# Altium schematic sheet RPI-CM3.SchDoc
size A2
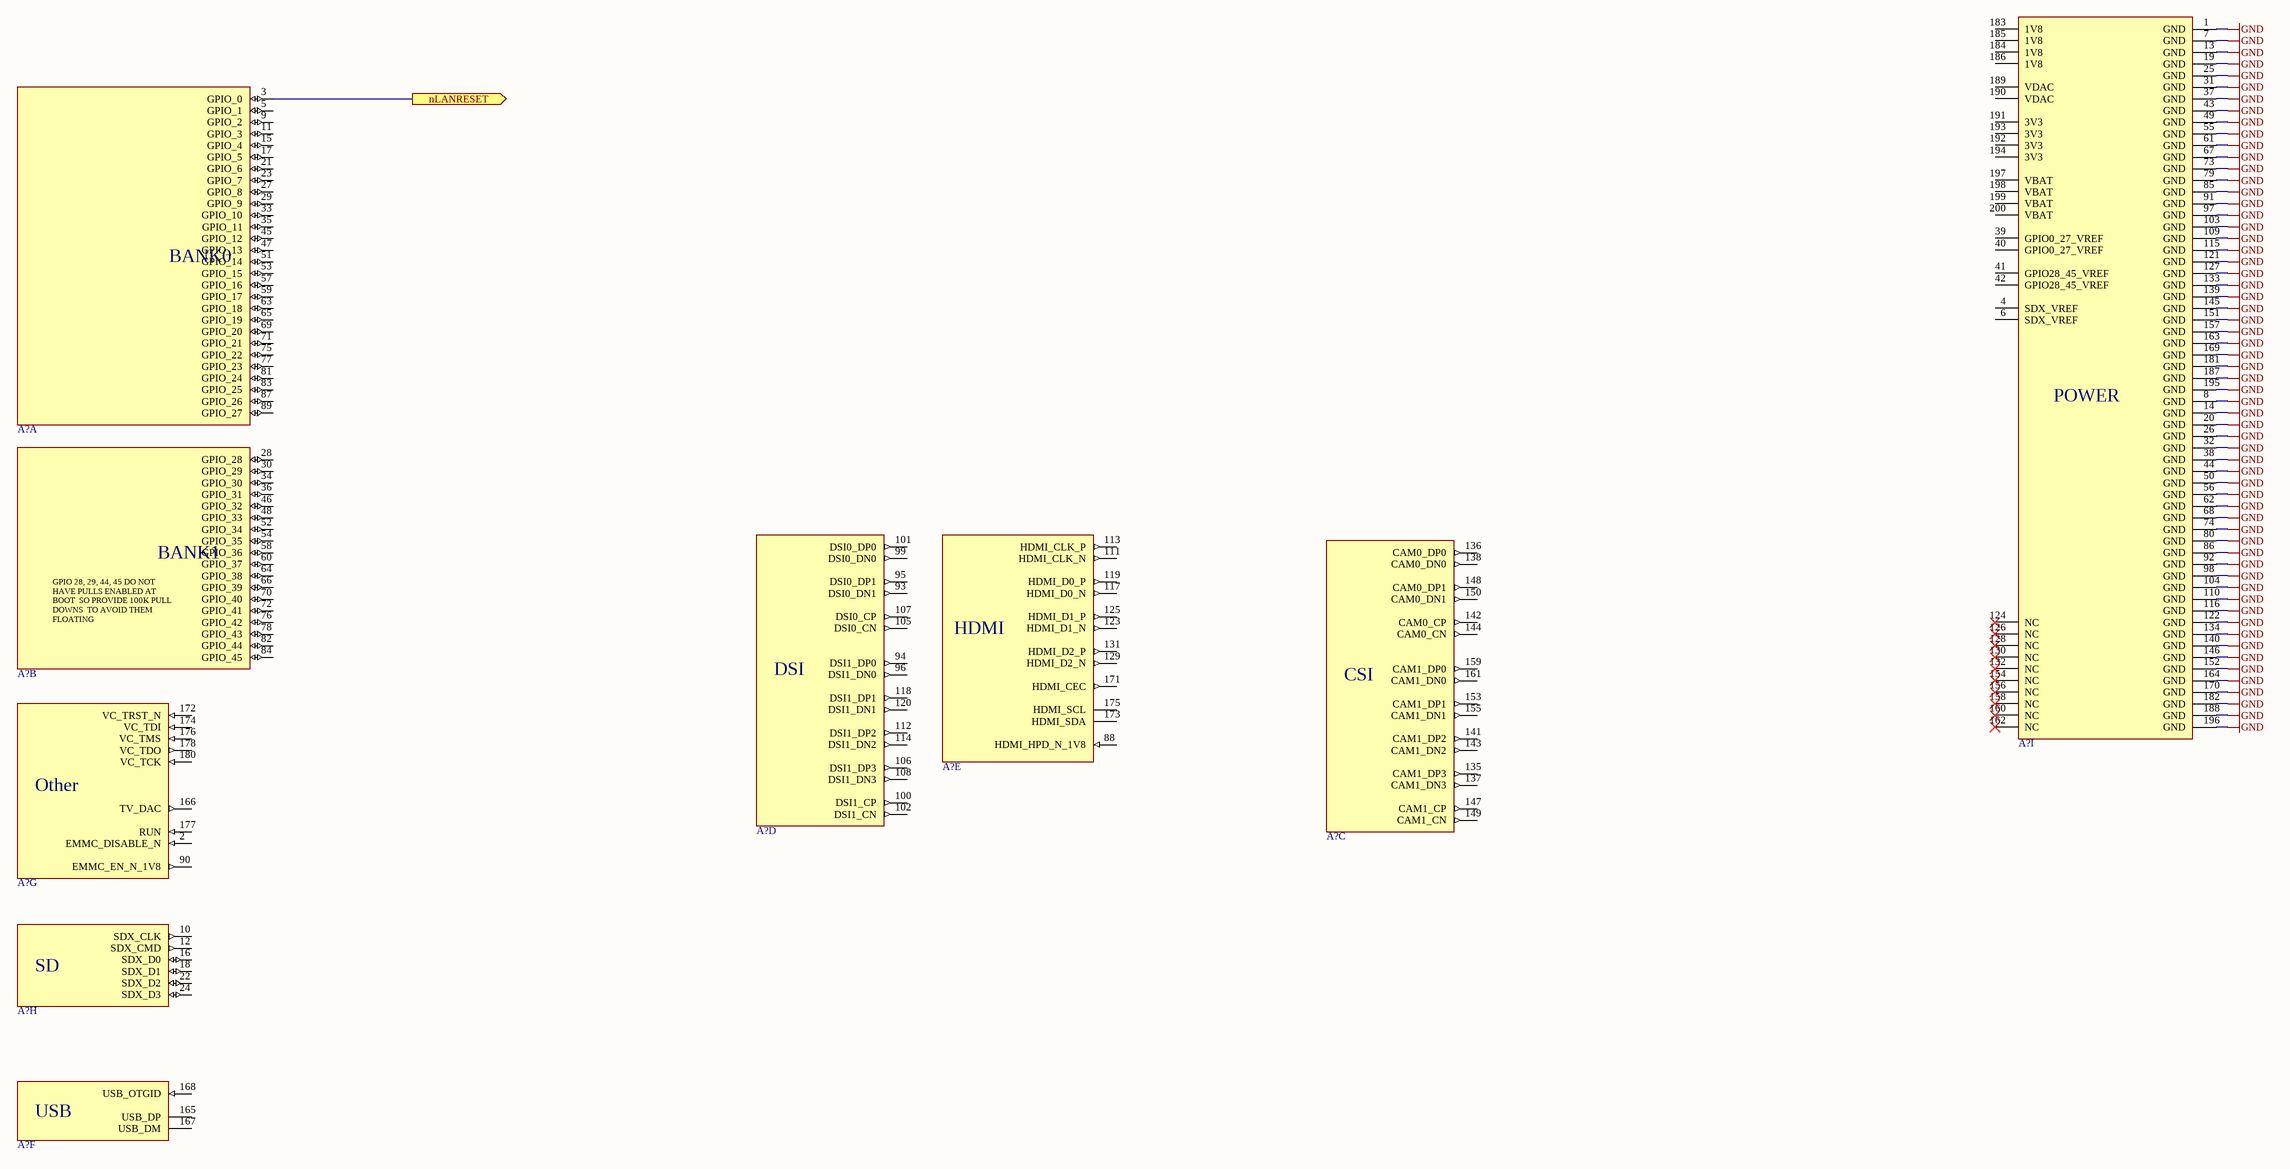
[diagram p0: RPI-CM3.SchDoc]

## Parts
(Parts that share a designator on the sheet are numbered #1, #2 ... from top to bottom, then left to right.)
A?#1  RPi-CM3  [SODIMM_TE_1717254-4_RPi_CM]  (value not drawn)  (part A of 9)
A?#2  RPi-CM3  [SODIMM_TE_1717254-4_RPi_CM]  (value not drawn)  (part B of 9)
A?#3  RPi-CM3  [SODIMM_TE_1717254-4_RPi_CM]  (value not drawn)  (part I of 9)
A?#4  RPi-CM3  [SODIMM_TE_1717254-4_RPi_CM]  (value not drawn)  (part E of 9)
A?#5  RPi-CM3  [SODIMM_TE_1717254-4_RPi_CM]  (value not drawn)  (part D of 9)
A?#6  RPi-CM3  [SODIMM_TE_1717254-4_RPi_CM]  (value not drawn)  (part C of 9)
A?#7  RPi-CM3  [SODIMM_TE_1717254-4_RPi_CM]  (value not drawn)  (part G of 9)
A?#8  RPi-CM3  [SODIMM_TE_1717254-4_RPi_CM]  (value not drawn)  (part H of 9)
A?#9  RPi-CM3  [SODIMM_TE_1717254-4_RPi_CM]  (value not drawn)  (part F of 9)

## Ports
nLANRESET (out)

## Nets
GND: A?#3.1(GND) A?#3.7(GND) A?#3.8(GND) A?#3.13(GND) A?#3.14(GND) A?#3.19(GND) A?#3.20(GND) A?#3.25(GND) A?#3.26(GND) A?#3.31(GND) A?#3.32(GND) A?#3.37(GND) A?#3.38(GND) A?#3.43(GND) A?#3.44(GND) A?#3.49(GND) A?#3.50(GND) A?#3.55(GND) A?#3.56(GND) A?#3.61(GND) A?#3.62(GND) A?#3.67(GND) A?#3.68(GND) A?#3.73(GND) A?#3.74(GND) A?#3.79(GND) A?#3.80(GND) A?#3.85(GND) A?#3.86(GND) A?#3.91(GND) A?#3.92(GND) A?#3.97(GND) A?#3.98(GND) A?#3.103(GND) A?#3.104(GND) A?#3.109(GND) A?#3.110(GND) A?#3.115(GND) A?#3.116(GND) A?#3.121(GND) A?#3.122(GND) A?#3.127(GND) A?#3.133(GND) A?#3.134(GND) A?#3.139(GND) A?#3.140(GND) A?#3.145(GND) A?#3.146(GND) A?#3.151(GND) A?#3.152(GND) A?#3.157(GND) A?#3.163(GND) A?#3.164(GND) A?#3.169(GND) A?#3.170(GND) A?#3.181(GND) A?#3.182(GND) A?#3.187(GND) A?#3.188(GND) A?#3.195(GND) A?#3.196(GND)
nLANRESET: A?#1.3(GPIO_0) ; port nLANRESET

Not connected (* = marked no-connect by the designer): A?#1 5(GPIO_1) 9(GPIO_2) 11(GPIO_3) 15(GPIO_4) 17(GPIO_5) 21(GPIO_6) 23(GPIO_7) 27(GPIO_8) 29(GPIO_9) 33(GPIO_10) 35(GPIO_11) 45(GPIO_12) 47(GPIO_13) 51(GPIO_14) 53(GPIO_15) 57(GPIO_16) 59(GPIO_17) 63(GPIO_18) 65(GPIO_19) 69(GPIO_20) 71(GPIO_21) 75(GPIO_22) 77(GPIO_23) 81(GPIO_24) 83(GPIO_25) 87(GPIO_26) 89(GPIO_27); A?#2 28(GPIO_28) 30(GPIO_29) 34(GPIO_30) 36(GPIO_31) 46(GPIO_32) 48(GPIO_33) 52(GPIO_34) 54(GPIO_35) 58(GPIO_36) 60(GPIO_37) 64(GPIO_38) 66(GPIO_39) 70(GPIO_40) 72(GPIO_41) 76(GPIO_42) 78(GPIO_43) 82(GPIO_44) 84(GPIO_45); A?#3 4(SDX_VREF) 6(SDX_VREF) 39(GPIO0_27_VREF) 40(GPIO0_27_VREF) 41(GPIO28_45_VREF) 42(GPIO28_45_VREF) 124(NC)* 126(NC)* 128(NC)* 130(NC)* 132(NC)* 154(NC)* 156(NC)* 158(NC)* 160(NC)* 162(NC)* 183(1V8) 184(1V8) 185(1V8) 186(1V8) 189(VDAC) 190(VDAC) 191(3V3) 192(3V3) 193(3V3) 194(3V3) 197(VBAT) 198(VBAT) 199(VBAT) 200(VBAT); A?#4 88(HDMI_HPD_N_1V8) 111(HDMI_CLK_N) 113(HDMI_CLK_P) 117(HDMI_D0_N) 119(HDMI_D0_P) 123(HDMI_D1_N) 125(HDMI_D1_P) 129(HDMI_D2_N) 131(HDMI_D2_P) 171(HDMI_CEC) 173(HDMI_SDA) 175(HDMI_SCL); A?#5 93(DSI0_DN1) 94(DSI1_DP0) 95(DSI0_DP1) 96(DSI1_DN0) 99(DSI0_DN0) 100(DSI1_CP) 101(DSI0_DP0) 102(DSI1_CN) 105(DSI0_CN) 106(DSI1_DP3) 107(DSI0_CP) 108(DSI1_DN3) 112(DSI1_DP2) 114(DSI1_DN2) 118(DSI1_DP1) 120(DSI1_DN1); A?#6 135(CAM1_DP3) 136(CAM0_DP0) 137(CAM1_DN3) 138(CAM0_DN0) 141(CAM1_DP2) 142(CAM0_CP) 143(CAM1_DN2) 144(CAM0_CN) 147(CAM1_CP) 148(CAM0_DP1) 149(CAM1_CN) 150(CAM0_DN1) 153(CAM1_DP1) 155(CAM1_DN1) 159(CAM1_DP0) 161(CAM1_DN0); A?#7 2(EMMC_DISABLE_N) 90(EMMC_EN_N_1V8) 166(TV_DAC) 172(VC_TRST_N) 174(VC_TDI) 176(VC_TMS) 177(RUN) 178(VC_TDO) 180(VC_TCK); A?#8 10(SDX_CLK) 12(SDX_CMD) 16(SDX_D0) 18(SDX_D1) 22(SDX_D2) 24(SDX_D3); A?#9 165(USB_DP) 167(USB_DM) 168(USB_OTGID)

## Notes on the sheet
- Title
- Size:
- Date:
- A3
- Number:
- Time:
- Revision:
- Sheet
- of
- File:
- (in symbol 040107-0001, part A) BANK0
- (in symbol 040107-0001, part B) BANK1; GPIO 28, 29, 44, 45 DO NOT  HAVE PULLS ENABLED AT BOOT  SO PROVIDE 100K PULL DOWNS  TO AVOID THEM FLOATING
- (in symbol 040107-0001, part C) CSI
- (in symbol 040107-0001, part D) DSI
- (in symbol 040107-0001, part E) HDMI
- (in symbol 040107-0001, part F) USB
- (in symbol 040107-0001, part G) Other
- (in symbol 040107-0001, part H) SD
- (in symbol 040107-0001, part I) POWER

## Library data of the parts
A?#1-A?#9 = 040107-0001: I# SOM RaspberryPi Compute Module 3 RPi-CM3; TempRange: -25/80°C; PartNumber: 040107-0001; Value: RPi-CM3; Info: RaspberryPi Compute Module 3